# Altium schematic sheet Microcontroller_STM32F04.SchDoc
size A; SheetNumber: 3; SheetTotal: 7
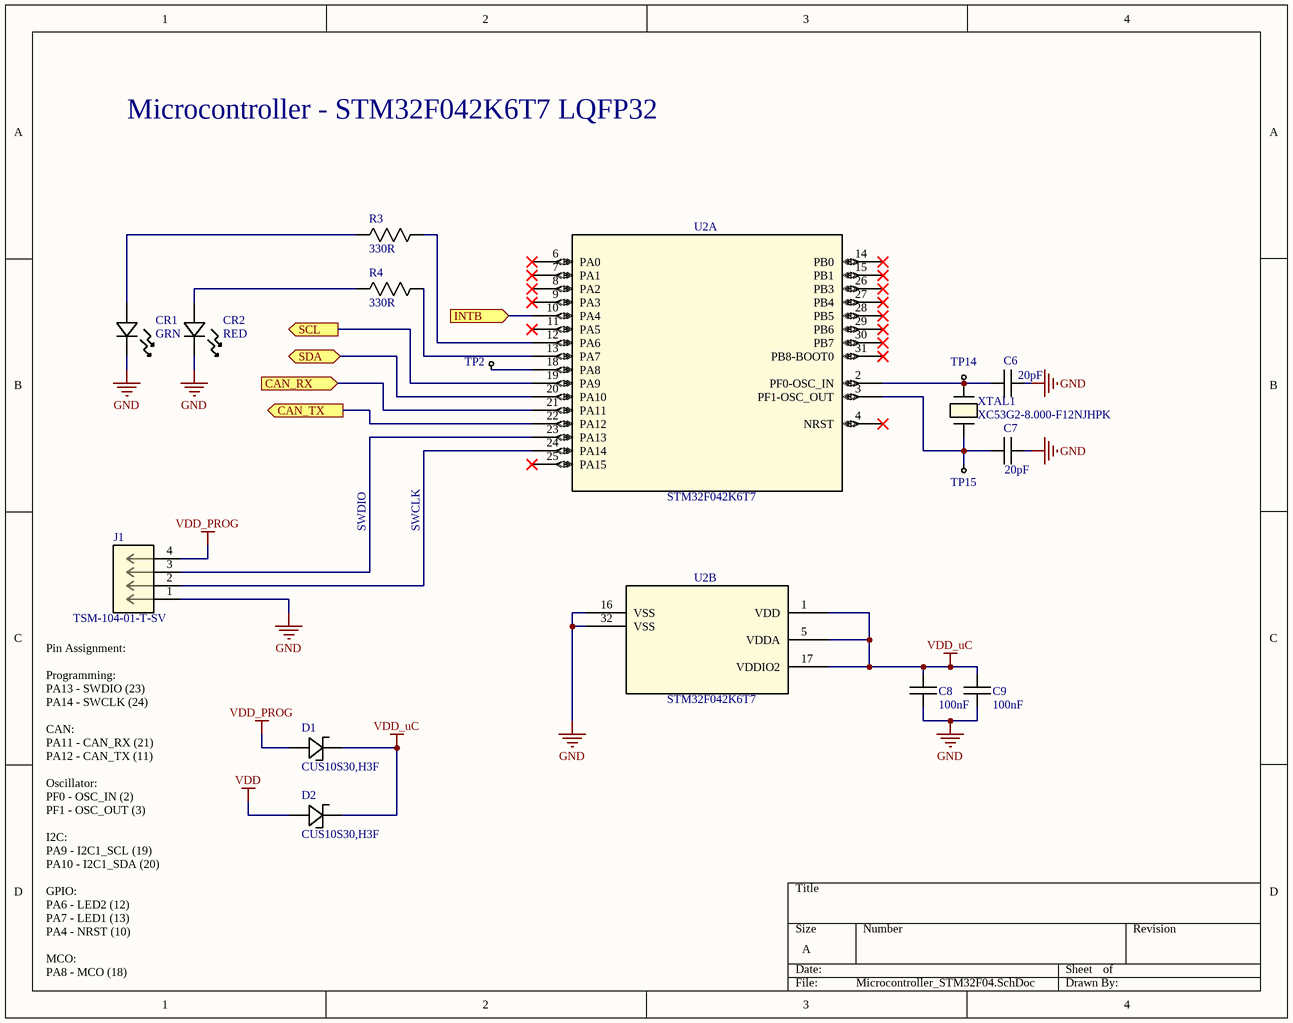
[diagram p0: Microcontroller_STM32F04.SchDoc]

## Parts
C6  20pF  [C0603]
C7  20pF  [C0603]
C8  100nF  [CAP0805]
C9  100nF  [CAP0805]
CR1  GRN  [LED_VISHAY_VLMX1300_VIS]
CR2  RED  [LED_VISHAY_VLMX1300_VIS]
D1  CUS10S30,H3F  [USC_TOS]
D2  CUS10S30,H3F  [USC_TOS]
J1  TSM-104-01-T-SV  [CONN_TSM-104-01-T-SV_SAI]
R3  330R  [R0603]
R4  330R  [R0603]
TP2  1mm Test Point  [TP_1MM]  (value not drawn)
TP14  1mm Test Point  [TP_1MM]  (value not drawn)
TP15  1mm Test Point  [TP_1MM]  (value not drawn)
U2  STM32F042K6T7  [LQFP-32]  (parts A,B of 2)
XTAL1  XC53G2-8.000-F12NJHPK  [XTAL_NX5032_NDK]

## Ports
CAN_RX (in, see CAN_TxRx[2B]), CAN_TX (out, see CAN_TxRx[2B]), INTB (in, see Sense_LDC1612[2C]), SCL (out, see HumTempSensor[3B], Sense_LDC1612[2B]), SDA (bidir, see HumTempSensor[3B], Sense_LDC1612[2B])

## Nets
GND: C6.1 C7.1 C8.2 C9.2 CR1.1 CR2.1 J1.1 U2.16(VSS) U2.32(VSS)
VDD: D2.2(anode)
VDD_PROG: D1.2(anode) J1.4
VDD_uC: C8.1 C9.1 D1.1(cathode) D2.1(cathode) U2.1(VDD) U2.5(VDDA) U2.17(VDDIO2)
CAN_RX: U2.21(PA11) ; port CAN_RX
CAN_TX: U2.22(PA12) ; port CAN_TX
INTB: U2.10(PA4) ; port INTB
SCL: U2.19(PA9) ; port SCL
SDA: U2.20(PA10) ; port SDA
NetC6_2: C6.2 TP14.1 U2.2(PF0-OSC_IN) XTAL1.2
NetC7_2: C7.2 TP15.1 U2.3(PF1-OSC_OUT) XTAL1.1
NetCR1_2: CR1.2 R3.2
NetCR2_2: CR2.2 R4.2
NetJ1_2: J1.2 U2.24(PA14)
NetJ1_3: J1.3 U2.23(PA13)
NetR3_1: R3.1 U2.12(PA6)
NetR4_1: R4.1 U2.13(PA7)
NetTP2_1: TP2.1 U2.18(PA8)

Not connected (* = marked no-connect by the designer): U2 4(NRST)* 6(PA0)* 7(PA1)* 8(PA2)* 9(PA3)* 11(PA5)* 14(PB0)* 15(PB1)* 25(PA15)* 26(PB3)* 27(PB4)* 28(PB5)* 29(PB6)* 30(PB7)* 31(PB8-BOOT0)*

## Notes on the sheet
- Microcontroller - STM32F042K6T7 LQFP32
- SWDIO
- SWCLK
- (near J1) Pin Assignment:
  Programming:
  PA13 - SWDIO (23)
  PA14 - SWCLK (24)
  CAN:
  PA11 - CAN_RX (21)
  PA12 - CAN_TX (11)
  Oscillator:
  PF0 - OSC_IN (2)
  PF1 - OSC_OUT (3)
  I2C:
  PA9 - I2C1_SCL (19)
  PA10 - I2C1_SDA (20)
  GPIO:
  PA6 - LED2 (12)
  PA7 - LED1 (13)
  PA4 - NRST (10)
  MCO:
  PA8 - MCO (18)

## Library data of the parts
C6 C7 = CL10C200JB8NNNC: Multilayer Ceramic Capacitor, 20 pF, 50 V, ± 5%, C0G (NP0), 0603 [1608 Metric]; Manufacturer: Samsung; Value: 20pF 50V; Voltage Rating: 50V; Temperature Coefficient: 300ppm/°C; Supplier: Digi-Key; Supplier Part Number: 1276-1187-1-ND; Manufacturer Part Number: CL10C200JB8NNNC; RoHS: Yes; Category: Ceramic Capacitors; Stock: 379574; Pricing: 1=0.1, 10=0.041, 50=0.0238, 100=0.0184, 500=0.01386, 1000=0.01089 (USD); Mounting Technology: Surface Mount; Case/Package: 0603; Case Code (Metric): 1608; Case Code (Imperial): 0603; Min Operating Temperature: -55°C; Max Operating Temperature: 125°C; Tolerance: 5%; Dielectric: C0G; Package Quantity: 1; Packaging: Tape and Reel; Voltage: 50V; Series: CL; Construction: Flat; Voltage Rating (DC): 50V; Length: 1.6mm; Width: 0.031inch; Height: 0.8mm; Thickness: 0.035inch; Depth: 0.8mm; Radiation Hardening: No; RoHS Compliant: Yes; ComponentLink1URL: https://datasheet.ciiva.com/26877/getdatasheetpartid-640634-26877974.pdf?src-supplier=Verical; ComponentLink1Description: https://datasheet.ciiva.com/26877/getdatasheetpartid-640634-26877974.pdf?src-supplier=Verical; ComponentLink2URL: https://datasheet.ciiva.com/26310/mlcc-catalogdownload2013-eng-26310315.pdf?src-supplier=Distrelec; ComponentLink2Description: https://datasheet.ciiva.com/26310/mlcc-catalogdownload2013-eng-26310315.pdf?src-supplier=Distrelec; LCSC Part#: C1648
C8 C9 = CC0805KRX7R9BB104: Multilayer Ceramic Capacitor, 0.1 uF, 50 V, ± 10%, X7R, 0805 [2012 Metric]; Manufacturer: Yageo; Value: 100nF 50V; Voltage: 50V; Insulation Resistance: 100GR; Supplier: Digi-Key; Supplier Part Number: 311-1140-1-ND; Manufacturer Part Number: CC0805KRX7R9BB104; RoHS: Yes; Category: Ceramic Capacitors; Stock: 6426664; Pricing: 1=0.1, 10=0.07, 50=0.0418, 100=0.0329, 500=0.02428, 1000=0.0201 (USD); Mounting Technology: Surface Mount; Case/Package: 0805; Pins: 2; Case Code (Metric): 2012; Case Code (Imperial): 0805; Material: Ceramic; Min Operating Temperature: -55°C; Max Operating Temperature: 125°C; Tolerance: 10%; Dielectric: X7R; Packaging: Tape and Reel; Voltage Rating: 50V; Package Quantity: 4000; Termination: SMD/SMT; Series: CC; Length: 2mm; Height: 0.85mm; Depth: 1.25mm; Radiation Hardening: No; RoHS Compliant: Yes; Reach SVHC Compliant: No; Lead Free: Lead Free; Halogen Free: Halogen Free; ComponentLink1URL: https://datasheet.ciiva.com/11786/0900766b80d84f1d-11786009.pdf?src-supplier=Rs; ComponentLink1Description: https://datasheet.ciiva.com/11786/0900766b80d84f1d-11786009.pdf?src-supplier=Rs; ComponentLink2URL: https://datasheet.ciiva.com/46393/1734573-46393307.pdf?src-supplier=Element14; ComponentLink2Description: https://datasheet.ciiva.com/46393/1734573-46393307.pdf?src-supplier=Element14; ComponentLink3URL: https://datasheet.ciiva.com/155/mlccorderingcode-155930.pdf?src-supplier=Digi-Key; ComponentLink3Description: https://datasheet.ciiva.com/155/mlccorderingcode-155930.pdf?src-supplier=Digi-Key; ComponentLink4URL: https://datasheet.ciiva.com/155/mlccorderingcode-155929.pdf?src-supplier=Digi-Key; ComponentLink4Description: https://datasheet.ciiva.com/155/mlccorderingcode-155929.pdf?src-supplier=Digi-Key; ComponentLink5URL: https://datasheet.ciiva.com/155/mlccorderingcode-155931.pdf?src-supplier=Digi-Key; ComponentLink5Description: https://datasheet.ciiva.com/155/mlccorderingcode-155931.pdf?src-supplier=Digi-Key; ComponentLink6URL: https://datasheet.ciiva.com/11464/upy-gphc-x7r-6-3v-to-50v-8-11464757.pdf?src-supplier=Avnet; ComponentLink6Description: https://datasheet.ciiva.com/11464/upy-gphc-x7r-6-3v-to-50v-8-11464757.pdf?src-supplier=Avnet; ComponentLink7URL: https://datasheet.ciiva.com/28450/1489800-28450805.pdf?src-supplier=Element14; ComponentLink7Description: https://datasheet.ciiva.com/28450/1489800-28450805.pdf?src-supplier=Element14; ComponentLink8URL: https://datasheet.ciiva.com/29242/445210-da-01-en-kerko-chip-0805-x7r-0-1uf-10proz-50vg-29242074.pdf?src-supplier=Conrad; ComponentLink8Description: https://datasheet.ciiva.com/29242/445210-da-01-en-kerko-chip-0805-x7r-0-1uf-10proz-50vg-29242074.pdf?src-supplier=Conrad; LCSC Part#: C49678
CR1 = VLMG1300-GS08: LED Uni-Color Yellow Green 574nm 2-Pin Chip 0603(1608Metric) T/R; Mfr_Name: Vishay; Manufacturer: Vishay Semiconductors; Type: DEV; Color: Green,Yellow; Lens Style: Rectangular,Clear; Forward Voltage: 2V; Viewing Angle: 130°; Luminous Intensity: 35mcd; Forward Current: 20mA; Wavelength: 571nm; Power Rating: 75mW; Number of Elements: 1; Reverse Voltage: 5V; Value: LED Green; Copyright: Copyright (C) 2023 Ultra Librarian. All rights reserved.; Manufacturer_Part_Number: VLMG1300-GS08; RefDes: RefDes; Supplier: Digi-Key; Supplier Part Number: VLMG1300-GS08CT-ND; Manufacturer Part Number: VLMG1300-GS08; RoHS: Yes; Category: LEDs; Stock: 55201; Pricing: 1=0.3, 10=0.237, 100=0.1065, 500=0.09616, 1000=0.07898 (USD); Mounting Technology: Surface Mount; Case/Package: 0603; Pins: 2; Case Code (Metric): 1608; Case Code (Imperial): 0603; Min Operating Temperature: -35°C; Max Operating Temperature: 85°C; Packaging: Tape and Reel; Illumination Color: Green,Yellow; Package Quantity: 1; Dominant Wavelength: 571nm; Test Current: 20mA; Power Dissipation: 75mW; Number of LEDs: 1; Series: CHipLED; Length: 1.6mm; Width: 0.8mm; Height: 0.8mm; Depth: 0.8mm; Radiation Hardening: No; Lead Free: Lead Free; RoHS Compliant: Yes; Reach SVHC Compliant: Unknown; ComponentLink1URL: https://datasheet.ciiva.com/26322/vlmo1300-26322139.pdf?src-supplier=Element14; ComponentLink1Description: https://datasheet.ciiva.com/26322/vlmo1300-26322139.pdf?src-supplier=Element14; ComponentLink2URL: https://datasheet.ciiva.com/26322/vlmo1300-26322140.pdf?src-supplier=Element14; ComponentLink2Description: https://datasheet.ciiva.com/26322/vlmo1300-26322140.pdf?src-supplier=Element14; ComponentLink3URL: https://datasheet.ciiva.com/8028/vlmo1300-8028023.pdf?src-supplier=Element14; ComponentLink3Description: https://datasheet.ciiva.com/8028/vlmo1300-8028023.pdf?src-supplier=Element14; ComponentLink4URL: https://datasheet.ciiva.com/9333/vlmo1300-9333390.pdf?src-supplier=Avnet; ComponentLink4Description: https://datasheet.ciiva.com/9333/vlmo1300-9333390.pdf?src-supplier=Avnet; LCSC Part#: C4749244
CR2 = VLMS1300-GS08: LED RED 0603 SMD; Mfr_Name: Vishay; Manufacturer: Vishay Semiconductors; Type: DEV; Viewing Angle: 130°; Lens Style: Rectangular,Clear; Number of LEDs: 1; Luminous Intensity: 54mcd; Forward Voltage: 2V; Wavelength: 631nm; Forward Current: 20mA; Power Rating: 75mW; Value: LED Red; Copyright: Copyright (C) 2023 Ultra Librarian. All rights reserved.; Manufacturer_Part_Number: VLMS1300-GS08; RefDes: RefDes; Supplier: Digi-Key; Supplier Part Number: VLMS1300-GS08CT-ND; Manufacturer Part Number: VLMS1300-GS08; RoHS: Yes; Category: LEDs; Stock: 28800; Pricing: 1=0.28, 10=0.223, 100=0.1002, 500=0.0905, 1000=0.07434 (USD); Mounting Technology: Surface Mount; Case/Package: 0603; Color: Red; Case Code (Metric): 1608; Case Code (Imperial): 0603; Min Operating Temperature: -35°C; Max Operating Temperature: 85°C; Package Quantity: 1; Packaging: Tape and Reel; Illumination Color: Red; Dominant Wavelength: 631nm; Test Current: 20mA; Series: CHipLED; Length: 1.6mm; Width: 0.8mm; Height: 0.8mm; Radiation Hardening: No; Lead Free: Lead Free; RoHS Compliant: Yes; Reach SVHC Compliant: Unknown; ComponentLink1URL: https://datasheet.ciiva.com/26322/vlmo1300-26322153.pdf?src-supplier=Element14; ComponentLink1Description: https://datasheet.ciiva.com/26322/vlmo1300-26322153.pdf?src-supplier=Element14; ComponentLink2URL: https://datasheet.ciiva.com/8028/vlmo1300-8028047.pdf?src-supplier=Element14; ComponentLink2Description: https://datasheet.ciiva.com/8028/vlmo1300-8028047.pdf?src-supplier=Element14; ComponentLink3URL: https://datasheet.ciiva.com/9333/vlmo1300-9333743.pdf?src-supplier=Avnet; ComponentLink3Description: https://datasheet.ciiva.com/9333/vlmo1300-9333743.pdf?src-supplier=Avnet; ComponentLink4URL: https://datasheet.ciiva.com/16510/vlmo1300-16510985.pdf?src-supplier=Future+Electronics; ComponentLink4Description: https://datasheet.ciiva.com/16510/vlmo1300-16510985.pdf?src-supplier=Future+Electronics; ComponentLink5URL: https://datasheet.ciiva.com/2114/vlmo1300-2114930.pdf?src-supplier=Digi-Key; ComponentLink5Description: https://datasheet.ciiva.com/2114/vlmo1300-2114930.pdf?src-supplier=Digi-Key; ComponentLink6URL: https://datasheet.ciiva.com/2114/vlmo1300-2114931.pdf?src-supplier=Digi-Key; ComponentLink6Description: https://datasheet.ciiva.com/2114/vlmo1300-2114931.pdf?src-supplier=Digi-Key; ComponentLink7URL: https://datasheet.ciiva.com/2114/vlmo1300-2114929.pdf?src-supplier=Digi-Key; ComponentLink7Description: https://datasheet.ciiva.com/2114/vlmo1300-2114929.pdf?src-supplier=Digi-Key; LCSC Part#: C83242
D1 D2 = CUS10S30,H3F: Rectifier Diode, Schottky, 1 Phase, 1 Element, 1A, 30V V(RRM), Silicon; Mfr_Name: Toshiba Electronic Devices & Storage Corp.; Manufacturer: Toshiba; Type: DEV; Max Reverse Current: 500uA; Peak Non-Repetitive Surge Current: 5A; Copyright: Copyright (C) 2023 Ultra Librarian. All rights reserved.; Manufacturer_Part_Number: CUS10S30,H3F; RefDes: RefDes; Supplier: Digi-Key; Supplier Part Number: CUS10S30H3FCT-ND; Manufacturer Part Number: CUS10S30,H3F; RoHS: Yes; Category: Rectifier Diodes; Stock: 308991; Pricing: 1=0.35, 10=0.243, 100=0.1228, 500=0.1002, 1000=0.07434 (USD); Mounting Technology: Surface Mount; Case/Package: SOD; Pins: 2; Contact Plating: Tin,Silver; Min Operating Temperature: -55°C; Max Operating Temperature: 125°C; Packaging: Cut Tape; Average Rectified Current: 1A; Max Reverse Voltage (DC): 30V; Series: -; RoHS Compliant: Yes; ComponentLink1URL: http://toshiba.semicon-storage.com/info/lookup.jsp?pid=CUS10S30&amp;lang=en&src-supplier=Mouser; ComponentLink1Description: http://toshiba.semicon-storage.com/info/lookup.jsp?pid=CUS10S30&amp;lang=en&src-supplier=Mouser; ComponentLink2URL: http://toshiba.semicon-storage.com/info/docget.jsp?did=14077&prodName=CUS10S30&src-supplier=Avnet; ComponentLink2Description: http://toshiba.semicon-storage.com/info/docget.jsp?did=14077&prodName=CUS10S30&src-supplier=Avnet; ComponentLink3URL: https://toshiba.semicon-storage.com/info/docget.jsp?did=14077&prodName=CUS10S30&src-supplier=Digi-Key; ComponentLink3Description: https://toshiba.semicon-storage.com/info/docget.jsp?did=14077&prodName=CUS10S30&src-supplier=Digi-Key; LCSC Part#: C146335; Value: CUS10S30,H3F
J1 = TSM-104-01-T-SV: Conn Unshrouded Header HDR 4 POS 2.54mm Solder ST Top Entry SMD Tube; Mfr_Name: Samtec Inc; Manufacturer: Samtec; Number of Contacts: 4; Gender: Male; Max Current Rating: 7A; Max Voltage Rating (AC): 475V; Copyright: Copyright (C) 2023 Ultra Librarian. All rights reserved.; Manufacturer_Part_Number: TSM-104-01-T-SV; RefDes: RefDes; Type: DEV; Supplier: Digi-Key; Supplier Part Number: SAM8983-ND; Manufacturer Part Number: TSM-104-01-T-SV; RoHS: Yes; Category: Headers and Wire Housings; Stock: 1177; Pricing: 1=0.65, 10=0.564, 100=0.4646, 500=0.404, 1000=0.3333, 5000=0.2929, 10000=0.2727 (USD); Mounting Technology: Surface Mount; Contact Plating: Tin; Contact Material: Bronze; Contact Shape: Square; Contact Finish - Mating: TIN; Insulation Material: Polymer; Insulation Color: Black; Housing Color: Black; Housing Material: Polymer; Color: Black; Min Operating Temperature: -55°C; Max Operating Temperature: 105°C; Number of Rows: 1; Packaging: Rail/Tube; Termination: Solder; Number of Positions: 4; Series: TSM; Contact Type: Male Pin; Connector Type: Header; Fastening Type: Pull; Orientation: Straight; Package Quantity: 1; Length: 10.16mm; Pitch: 2.54mm; Depth: 2.54mm; Contact Mating Length: 0.23inch; Radiation Hardening: No; Lead Free: Lead Free; RoHS Compliant: Yes; Flammability Rating: UL94 V-0; Reach SVHC Compliant: No; ComponentLink1URL: https://datasheet.ciiva.com/739/tsm-1xx-xx-xxx-sv-xx-xxx-xx-mkt-739625.pdf?src-supplier=Digi-Key; ComponentLink1Description: https://datasheet.ciiva.com/739/tsm-1xx-xx-xxx-sv-xx-xxx-xx-mkt-739625.pdf?src-supplier=Digi-Key; LCSC Part#: C3335977; Value: TSM-104-01-T-SV
R3 R4 = RC0603JR-13330RL: Res Thick Film 0603 330 Ohm 5% 0.1W(1/10W) ±100ppm/C Pad SMD T/R; Manufacturer: Yageo; Temperature Coefficient: 100ppm/°C; Power Rating: 100mW; Voltage Rating: 50V; Supplier: Digi-Key; Supplier Part Number: 13-RC0603JR-13330RLCT-ND; Manufacturer Part Number: RC0603JR-13330RL; RoHS: Yes; Category: Chip SMD Resistors; Stock: 83710; Pricing: 1=0.1, 10=0.015, 50=0.0092, 100=0.0076, 500=0.00512, 1000=0.00437, 5000=0.00314, 10000=0.00275 (USD); Case/Package: 0603; Contact Plating: Tin,Lead; Case Code (Imperial): 0603; Case Code (Metric): 1608; Min Operating Temperature: -55°C; Max Operating Temperature: 155°C; Value: 330R; Tolerance: 5%; Packaging: Tape and Reel; Termination: SMD/SMT; Series: RC; Length: 1.6mm; Width: 0.8mm; Height: 0.45mm; Lead Free: Lead Free; RoHS Compliant: Yes; ComponentLink1URL: http://www.mouser.com/ds/2/447/RC0603-272842.pdf?src-supplier=Mouser; ComponentLink1Description: http://www.mouser.com/ds/2/447/RC0603-272842.pdf?src-supplier=Mouser; ComponentLink2URL: https://datasheet.octopart.com/RC0603JR-13330RL-Yageo-datasheet-164759695.pdf?src-supplier=Future+Electronics; ComponentLink2Description: https://datasheet.octopart.com/RC0603JR-13330RL-Yageo-datasheet-164759695.pdf?src-supplier=Future+Electronics; ComponentLink3URL: http://www.yageo.com/pdf/PYu-RC0603_51_RoHS_L_4.pdf?src-supplier=Avnet; ComponentLink3Description: http://www.yageo.com/pdf/PYu-RC0603_51_RoHS_L_4.pdf?src-supplier=Avnet; LCSC Part#: C3995110
TP2 TP14 TP15 = TestPoint_1mm
U2 = STM32F042K6T7: ARM® Cortex®-M0 STM32 F0 Microcontroller IC 32-Bit 48MHz 32KB (32K x 8) FLASH 32-LQFP (7x7); Mfr_Name: STMicroelectronics; RAM Size: 6KB; Max Power Dissipation: 351mW; Interface: I2C,SPI,USB,CAN,HDMI,IrDA,UART,USART,LIN,I2S; Number of I/Os: 26; Number of Timers/Counters: 6; Oscillator Type: Internal; Data Bus Width: 32b; Min Supply Voltage: 2V; Max Supply Voltage: 3.6V; Watchdog Timer: Yes; Peripherals: POR,PWM,WDT,DMA; Core Architecture: ARM; Copyright: Copyright (C) 2023 Ultra Librarian. All rights reserved.; Manufacturer_Part_Number: STM32F042K6T7; RefDes: RefDes; Type: DEV; Supplier: Digi-Key; Supplier Part Number: 497-18516-ND; Manufacturer: STMicroelectronics; Manufacturer Part Number: STM32F042K6T7; RoHS: Yes; Category: Microcontrollers; Stock: 2881; Pricing: 1=4.08, 10=3.669, 25=3.4684, 80=3.00588, 250=2.85172, 500=2.55882, 1000=2.15805, 2500=2.05014, 5000=1.97307 (USD); Case/Package: LQFP; Pins: 32; Min Operating Temperature: -40°C; Max Operating Temperature: 105°C; Packaging: Tray; Frequency: 48MHz; Number of Programmable I/O: 26; Clock Frequency: 48MHz; Memory Format: FLASH; Memory Size: 32KB; Series: STM32 F0; Radiation Hardening: No; Reach SVHC Compliant: No; Lead Free: Lead Free; RoHS Compliant: Yes; ComponentLink1URL: http://www.farnell.com/datasheets/2281753.pdf?src-supplier=Farnell; ComponentLink1Description: http://www.farnell.com/datasheets/2281753.pdf?src-supplier=Farnell; ComponentLink2URL: http://www.mouser.com/ds/2/389/stm32f042c4-956225.pdf?src-supplier=Mouser; ComponentLink2Description: http://www.mouser.com/ds/2/389/stm32f042c4-956225.pdf?src-supplier=Mouser; ComponentLink3URL: http://www.st.com/content/ccc/resource/technical/document/datasheet/52/ad/d0/80/e6/be/40/ad/DM00105814.pdf/files/DM00105814.pdf/jcr:content/translations/en.DM00105814.pdf?src-supplier=Digi-Key; ComponentLink3Description: http://www.st.com/content/ccc/resource/technical/document/datasheet/52/ad/d0/80/e6/be/40/ad/DM00105814.pdf/files/DM00105814.pdf/jcr:content/translations/en.DM00105814.pdf?src-supplier=Digi-Key; ComponentLink4URL: http://www.st.com/st-web-ui/static/active/en/resource/technical/document/datasheet/DM00105814.pdf?src-supplier=Avnet; ComponentLink4Description: http://www.st.com/st-web-ui/static/active/en/resource/technical/document/datasheet/DM00105814.pdf?src-supplier=Avnet; ComponentLink5URL: http://www.farnell.com/datasheets/1886881.pdf?src-supplier=Element14; ComponentLink5Description: http://www.farnell.com/datasheets/1886881.pdf?src-supplier=Element14; ComponentLink6URL: http://www.farnell.com/datasheets/2281753.pdf?src-supplier=Newark; ComponentLink6Description: http://www.farnell.com/datasheets/2281753.pdf?src-supplier=Newark; ComponentLink7URL: https://datasheet.octopart.com/STM32F042K6T7-STMicroelectronics-datasheet-62336640.pdf?src-supplier=LKR; ComponentLink7Description: https://datasheet.octopart.com/STM32F042K6T7-STMicroelectronics-datasheet-62336640.pdf?src-supplier=LKR; ComponentLink8URL: https://datasheet.octopart.com/STM32F042K6T7-STMicroelectronics-datasheet-82511004.pdf?src-supplier=SHENGYU+ELECTRONICS; ComponentLink8Description: https://datasheet.octopart.com/STM32F042K6T7-STMicroelectronics-datasheet-82511004.pdf?src-supplier=SHENGYU+ELECTRONICS; LCSC Part#: C1337340; Value: STM32F042K6T7
XTAL1 = XC53G2-8.000-F12NJHP: CRYSTAL 8MHZ 12PF SMD; Mfr_Name: HCI; Copyright: Copyright (C) 2023 Ultra Librarian. All rights reserved.; Manufacturer_Part_Number: XC53G2-8.000-F12NJHPK; RefDes: RefDes; Type: DEV; Value: XC53G2-8.000-F12NJHPK; LCSC Part#: C2842269